# Altium project CurrentSens.PrjPCB
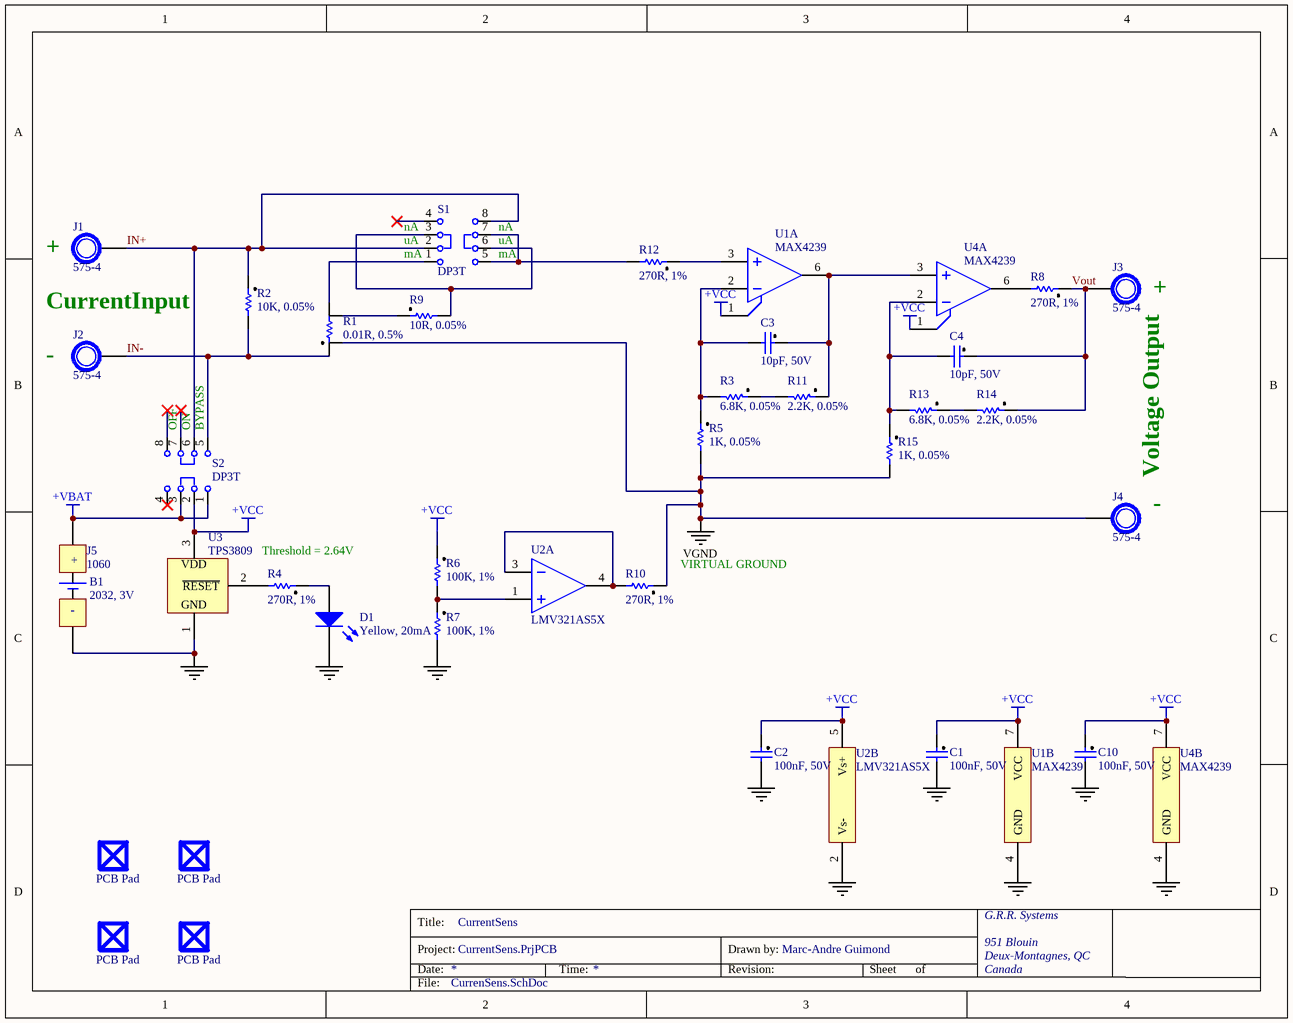
[diagram p0: CurrenSens.SchDoc]
1 sheet, 37 parts. Net scope: global (net labels, ports and power ports of the same name join across sheets).
Board files: CurrentSens.PcbDoc, TempSens_Panel.PcbDoc

## Sheet CurrenSens.SchDoc: CurrentSens
size A; DrawnBy: Marc-Andre Guimond; Organization: G.R.R. Systems; Address2: 951 Blouin; Address3: Deux-Montagnes, QC; Address4: Canada

### Parts
B1  2032, 3V  [NO_FOOT]
C1  100nF, 50V  [0603 (1608 Metric)]
C2  100nF, 50V  [0603 (1608 Metric)]
C3  10pF, 50V  [0603 (1608 Metric)]
C4  10pF, 50V  [0603 (1608 Metric)]
C10  100nF, 50V  [0603 (1608 Metric)]
D1  Yellow, 20mA  [1206 (3216 Metric)]
H1  PCB Pad  [SJ-5518]
H2  PCB Pad  [SJ-5518]
H3  PCB Pad  [SJ-5518]
H4  PCB Pad  [SJ-5518]
J1  575-4  [CON_BANANA_TH_NI]
J2  575-4  [CON_BANANA_TH_NI]
J3  575-4  [CON_BANANA_TH_NI]
J4  575-4  [CON_BANANA_TH_NI]
J5  1060  [1060]
R1  0.01R, 0.5%  [2512 (6432 Metric)]
R2  10K, 0.05%  [0603 (1608 Metric)]
R3  6.8K, 0.05%  [0603 (1608 Metric)]
R4  270R, 1%  [0603 (1608 Metric)]
R5  1K, 0.05%  [0603 (1608 Metric)]
R6  100K, 1%  [0603 (1608 Metric)]
R7  100K, 1%  [0603 (1608 Metric)]
R8  270R, 1%  [0603 (1608 Metric)]
R9  10R, 0.05%  [0805 (2012 Metric)]
R10  270R, 1%  [0603 (1608 Metric)]
R11  2.2K, 0.05%  [0603 (1608 Metric)]
R12  270R, 1%  [0603 (1608 Metric)]
R13  6.8K, 0.05%  [0603 (1608 Metric)]
R14  2.2K, 0.05%  [0603 (1608 Metric)]
R15  1K, 0.05%  [0603 (1608 Metric)]
S1  DP3T  [L203-MS]
S2  DP3T  [L203-MS]
U1  MAX4239  [SOIC8_154MIL]  (parts A,B of 2)
U2  LMV321AS5X  [SOT23-5]  (parts A,B of 2)
U3  TPS3809  [SOT23-3]
U4  MAX4239  [SOIC8_154MIL]  (parts A,B of 2)

### Nets
+VBAT: J5.1 S2.1 S2.3
+VCC: C1.1 C2.1 C10.1 R6.1 S2.2 U1.1(~{SHDN}) U1.7(VCC) U2.5(Vs+) U3.3(VDD) U4.1(~{SHDN}) U4.7(VCC)
GND: C1.2 C2.2 C10.2 D1.2(K) J5.2 R7.2 U1.4(GND) U2.2(Vs-) U3.1(GND) U4.4(GND)
VGND: J4.1 R1.3 R5.2 R10.1 R15.2
IN+: J1.1 R2.1 S1.2 S1.8 S2.6
IN-: J2.1 R1.1 R2.2 S2.5
Vout: C4.1 J3.1 R8.1 R14.1
NetC3_1: C3.1 R11.1 U1.6(OUT) U4.3(IN+)
NetC3_2: C3.2 R3.2 R5.1 U1.2(IN-)
NetC4_2: C4.2 R13.2 R15.1 U4.2(IN-)
NetD1_1: D1.1(A) R4.1
NetR1_2: R1.2 S1.1
NetR1_4: R1.4 R9.1
NetR3_1: R3.1 R11.2
NetR4_2: R4.2 U3.2(~{RESET})
NetR6_2: R6.2 R7.1 U2.1(IN+)
NetR8_2: R8.2 U4.6(OUT)
NetR9_2: R9.2 S1.3 S1.6
NetR10_2: R10.2 U2.3(IN-) U2.4(OUT)
NetR12_1: R12.1 U1.3(IN+)
NetR12_2: R12.2 S1.5 S1.7
NetR13_1: R13.1 R14.2

Not connected (* = marked no-connect by the designer): S1 4*; S2 4* 7* 8*; U1 5(NC) 8(NC); U4 5(NC) 8(NC)

### Notes on the sheet
- (near S1) nA
- (near J1) +
- (near S1) mA
- (near S1) uA
- (near J3) +
- (near J2) -
- CurrentInput
- (near S2) OFF
- (near S2) ON
- (near S2) BYPASS
- Voltage Output
- Threshold = 2.64V
- (near R10) VIRTUAL GROUND
- (near J4) -
- Title:
- Date:
- Project:
- Time:
- Revision:
- Drawn by:
- Sheet
- of
- File:
- (in symbol 1060) +; -

### Library data of the parts
B1 = CR2032: BATTERY LITHIUM COIN 3V 20MM; Manufacturer: Panasonic - BSG; Battery Cell Size: Coin, 20.0mm; Capacity: 225mAh; Discharge Rate: 200µA; Shipping Info: Due to possible restrictions, a change in ship method may be required.; Supplier 1: Digi-Key; Manufacturer Part Number: CR2032; RoHS: RoHS Compliant By Exemption; Category: Battery Products; Stock 1: 780134; Pricing 1: 1=0.34, 10=0.307, 50=0.2732, 200=0.2391, 400=0.21858, 600=0.20492, 1000=0.18785, 2600=0.17641 (CAD); Battery Chemistry: Lithium; Voltage - Rated: 3V; Size / Dimension: 0.79" Dia x 0.13" H (20.0mm x 3.2mm); Termination Style: Requires Holder; Weight: 0.1 oz (2.85g); ComponentLink1URL: http://na.industrial.panasonic.com/sites/default/pidsa/files/crseries_datasheets_merged.pdf; ComponentLink1Description: http://na.industrial.panasonic.com/sites/default/pidsa/files/crseries_datasheets_merged.pdf; GRRComment: 2032, 3V; Emplacement: *
C1 C2 C10 = CL10B104KB8SFNC: CAP CER 100NF 50V 10% X7R 0603; Manufacturer: Samsung Electro-Mechanics America, Inc; Supplier 1: Digi-Key; Manufacturer Part Number: CL10B104KB8SFNC; RoHS: RoHS Compliant; Category: Capacitors; Stock 1: 719425; Pricing 1: 1=0.12, 10=0.024, 25=0.0168, 50=0.013, 100=0.011, 250=0.00896, 500=0.00766, 1000=0.00597 (CAD); Packaging: Cut Tape (CT); Capacitance: 100nF; Tolerance: ±10%; Voltage - Rated: 50V; Temperature Coefficient: X7R; Mounting Type: Surface Mount, MLCC; Operating Temperature: -55°C ~ 125°C; Applications: Boardflex Sensitive; Ratings: -; Package / Case: 0603 (1608 Metric); Size / Dimension: 0.063" L x 0.031" W (1.60mm x 0.80mm); Height - Seated (Max): -; Thickness (Max): 0.035" (0.90mm); Lead Spacing: -; Features: Soft Termination; Lead Style: -; ComponentLink1URL: http://www.samsungsem.com/servlet/FileDownload?type=spec&file=CL10B104KB8SFNC.pdf; ComponentLink1Description: http://www.samsungsem.com/servlet/FileDownload?type=spec&file=CL10B104KB8SFNC.pdf; Supplier Part Number 1: 1276-1936-1-ND; Emplacement: *; GRRComment: 100nF, 50V
C3 C4 = CL10C100JB8NCNC: CAP CER 10PF 50V 5% NP0 0603; Manufacturer: Samsung Electro-Mechanics America, Inc; Temperature Coefficient: C0G, NP0; Emplacement: *; GRRComment: 10pF, 50V; Supplier 1: Digi-Key; Manufacturer Part Number: CL10C100JB8NCNC; RoHS: RoHS Compliant; Category: Capacitors; Stock 1: 90519; Pricing 1: 1=0.12, 25=0.008, 50=0.0066, 100=0.0054, 250=0.00444, 500=0.00382, 1000=0.00297 (CAD); Packaging: Cut Tape (CT); Capacitance: 10pF; Tolerance: ±5%; Voltage - Rated: 50V; Mounting Type: Surface Mount, MLCC; Operating Temperature: -55°C ~ 125°C; Applications: General Purpose; Ratings: -; Package / Case: 0603 (1608 Metric); Size / Dimension: 0.063" L x 0.031" W (1.60mm x 0.80mm); Height - Seated (Max): -; Thickness (Max): 0.035" (0.90mm); Lead Spacing: -; Features: -; Lead Style: -; ComponentLink1URL: http://www.samsungsem.com/servlet/FileDownload?type=spec&file=CL10C100JB8NCNC.pdf; ComponentLink1Description: http://www.samsungsem.com/servlet/FileDownload?type=spec&file=CL10C100JB8NCNC.pdf; Supplier Part Number 1: 1276-2154-1-ND
D1 = APTR3216SYCK: LED 3.2X1.6MM 590NM YLW CLR SMD; Manufacturer: Kingbright; Millicandela Rating: 150mcd; Voltage - Forward (Vf) (Typ): 2V; Viewing Angle: 120°; Lens Type: Clear; Lens Style/Size: Rectangle with Flat Top, 1.6mm x 1.4mm; Supplier 1: Digi-Key; Manufacturer Part Number: APTR3216SYCK; RoHS: RoHS Compliant; Category: Optoelectronics; Stock 1: 53956; Pricing 1: 1=0.25, 10=0.191, 25=0.152, 100=0.1372, 250=0.1266, 500=0.11394 (CAD); Packaging: Cut Tape (CT); Color: Yellow; Wavelength - Dominant: 590nm; Wavelength - Peak: 590nm; Current - Test: 20mA; Package / Case: 1206 (3216 Metric); Size / Dimension: 3.20mm L x 1.60mm W; Height: 1.05mm; Mounting Type: Surface Mount, Bottom Entry; Luminous Flux @ Current - Test: -; ComponentLink1URL: http://www.kingbrightusa.com/images/catalog/SPEC/APTR3216SYCK.pdf; ComponentLink1Description: http://www.kingbrightusa.com/images/catalog/SPEC/APTR3216SYCK.pdf; Supplier Part Number 1: 754-1174-1-ND; GRRComment: Yellow, 20mA; Emplacement: *
H1-H4 = SJ-5518 (BLACK): BUMPER SQUARE 0.5"L X 0.5"W BLK; Manufacturer: 3M; Shape: Square, Tapered; Hardness: 72 Shore M; Form: Sheet; GRRComment: PCB Pad; Emplacement: *; Supplier 1: Digi-Key; Manufacturer Part Number: SJ-5518 (BLACK); RoHS: RoHS Compliant; Category: Hardware, Fasteners, Accessories; Stock 1: 17272; Pricing 1: 64=0.13188 (CAD); Color: Black; Size / Dimension: 0.500" L x 0.500" W (12.70mm x 12.70mm); Thickness: 0.230" (5.84mm); Material: Polyurethane; Mounting Type: Adhesive, Rubber; ComponentLink1URL: http://multimedia.3m.com/mws/mediawebserver?6666660Zjcf6lVs6EVs666cIsCOrrrrQ-; ComponentLink1Description: http://multimedia.3m.com/mws/mediawebserver?6666660Zjcf6lVs6EVs666cIsCOrrrrQ-; Supplier Part Number 1: SJ5518-0-ND
J1-J4 = 575-4: JACK NON-INSULATED .218"; Manufacturer: Keystone Electronics; Gender: Female; Plug/Mating Plug Diameter: Standard; Supplier 1: Digi-Key; Manufacturer Part Number: 575-4; RoHS: RoHS Compliant; Category: Connectors, Interconnects; Stock 1: 33338; Pricing 1: 1=1.21, 10=0.938, 50=0.75, 100=0.7189, 250=0.65632, 500=0.62508, 1000=0.52488, 2500=0.46881, 5000=0.45318 (CAD); Packaging: Bulk; Type: Banana Jack; Mounting Type: Through Hole; Termination: Solder; Insulation: Non-Insulated; Features: -; Color: -; Contact Finish: Nickel; Contact Material: Brass; Body Material: -; Wire Gauge: -; Operating Temperature: -; ComponentLink1URL: http://www.keyelco.com/product-pdf.cfm?p=2379; ComponentLink1Description: http://www.keyelco.com/product-pdf.cfm?p=2379; Supplier Part Number 1: 575-4K-ND; Emplacement: *; GRRComment: 575-4
J5 = 1060: HOLDER BATT COIN 2032 20MM SMD; Manufacturer: Keystone Electronics; Battery Type, Function: Coin Cell, Holder; Style: Holder (Open); Battery Cell Size: Coin, 20.0mm; Number of Cells: 1; Battery Series: 2032; Supplier 1: Digi-Key; Manufacturer Part Number: 1060; RoHS: RoHS Compliant; Category: Battery Products; Stock 1: 7552; Pricing 1: 1=2.18, 10=1.8, 50=1.6158, 100=1.5424, 250=1.39548, 500=1.28532, 1000=1.23456, 2500=1.1017, 5000=0.97684 (CAD); Mounting Type: PCB, Surface Mount; Termination Style: SMD (SMT) Tab; Height Above Board: 0.217" (5.50mm); Operating Temperature: -50°C ~ 145°C; ComponentLink1URL: http://www.keyelco.com/product-pdf.cfm?p=726; ComponentLink1Description: http://www.keyelco.com/product-pdf.cfm?p=726; Supplier Part Number 1: 1060K-ND; Emplacement: *; GRRComment: 1060
R1 = LVK24R010DER: RES 0.01 OHM 1W 0.5% 2412; Manufacturer: Ohmite; Resistance (Ohms): 0.01; Temperature Coefficient: ±50ppm/°C; GRRComment: 0.01R, 0.5%; Emplacement: *; Supplier 1: Digi-Key; Manufacturer Part Number: LVK24R010DER; RoHS: RoHS Compliant; Category: Resistors; Stock 1: 1068; Pricing 1: 1=2.13, 10=1.887, 25=1.736, 50=1.5834, 100=1.3703, 250=1.15716, 500=0.97446 (CAD); Packaging: Cut Tape (CT); Tolerance: ±0.5%; Power (Watts): 1W; Composition: Thick Film; Features: Current Sense, Moisture Resistant; Package / Case: 2512 (6432 Metric); Supplier Device Package: 2412; Size / Dimension: 0.252" L x 0.126" W (6.40mm x 3.20mm); Height: 0.026" (0.65mm); Number of Terminations: 4; ComponentLink1URL: http://www.ohmite.com/cat/res_lvk.pdf; ComponentLink1Description: http://www.ohmite.com/cat/res_lvk.pdf; Supplier Part Number 1: LVK24R010DERCT-ND
R2 = RG1608N-103-W-T1: RES 10.0K OHM 1/10W .05% 0603SMD; Manufacturer: Susumu; Power (Watts): 0.1W, 1/10W; Temperature Coefficient: ±10ppm/°C; Supplier 1: Digi-Key; Manufacturer Part Number: RG1608N-103-W-T1; RoHS: RoHS Compliant; Category: Resistors; Stock 1: 91075; Pricing 1: 1=1.19, 10=1.041, 50=0.8358, 100=0.7253, 250=0.63096, 500=0.5231 (CAD); Packaging: Cut Tape (CT); Resistance (Ohms): 10k; Tolerance: ±0.05%; Composition: Thin Film; Features: -; Package / Case: 0603 (1608 Metric); Supplier Device Package: 0603; Size / Dimension: 0.063" L x 0.031" W (1.60mm x 0.80mm); Height: 0.020" (0.50mm); Number of Terminations: 2; ComponentLink1URL: http://www.susumu-usa.com/pdf/RG_RM_RGH_DATASHEET.pdf; ComponentLink1Description: http://www.susumu-usa.com/pdf/RG_RM_RGH_DATASHEET.pdf; Supplier Part Number 1: RG16N10.0KWCT-ND; Emplacement: *; GRRComment: 10K, 0.05%
R3 R13 = RG1608N-682-W-T1: RES 6.8K OHM 1/10W .05% 0603 SMD; Manufacturer: Susumu; Power (Watts): 0.1W, 1/10W; Temperature Coefficient: ±10ppm/°C; Supplier 1: Digi-Key; Manufacturer Part Number: RG1608N-682-W-T1; RoHS: RoHS Compliant; Category: Resistors; Stock 1: 4099; Pricing 1: 1=1.19, 10=1.041, 50=0.8358, 100=0.7253, 250=0.63096, 500=0.5231 (CAD); Packaging: Cut Tape (CT); Resistance (Ohms): 6.8k; Tolerance: ±0.05%; Composition: Thin Film; Features: -; Package / Case: 0603 (1608 Metric); Supplier Device Package: 0603; Size / Dimension: 0.063" L x 0.031" W (1.60mm x 0.80mm); Height: 0.020" (0.50mm); Number of Terminations: 2; ComponentLink1URL: http://www.susumu-usa.com/pdf/RG_RM_RGH_DATASHEET.pdf; ComponentLink1Description: http://www.susumu-usa.com/pdf/RG_RM_RGH_DATASHEET.pdf; Supplier Part Number 1: RG16N6.8KWCT-ND; GRRComment: 6.8K, 0.05%
R4 R8 R10 R12 = RMCF0805FT270R: RES 270 OHM 1/8W 1% 0805; Manufacturer: Stackpole Electronics Inc; Resistance (Ohms): 270; Power (Watts): 0.125W, 1/8W; Temperature Coefficient: ±100ppm/°C; Supplier 1: Digi-Key; Manufacturer Part Number: RMCF0805FT270R; RoHS: RoHS Compliant; Category: Resistors; Stock 1: 23909; Pricing 1: 1=0.13, 10=0.037, 50=0.0208, 100=0.0158, 250=0.01172, 500=0.00862, 1000=0.00575, 2500=0.00485 (CAD); Packaging: Cut Tape (CT); Tolerance: ±1%; Composition: Thick Film; Features: -; Package / Case: 0805 (2012 Metric); Supplier Device Package: 0805; Size / Dimension: 0.079" L x 0.049" W (2.00mm x 1.25mm); Height: 0.026" (0.65mm); Number of Terminations: 2; ComponentLink1URL: http://www.seielect.com/Catalog/SEI-RMCF_RMCP.pdf; ComponentLink1Description: http://www.seielect.com/Catalog/SEI-RMCF_RMCP.pdf; Supplier Part Number 1: RMCF0805FT270RCT-ND; Emplacement: *; GRRComment: 270R, 1%
R5 R15 = RG1608N-102-W-T1: RES 1K OHM 1/10W .05% 0603 SMD; Manufacturer: Susumu; Power (Watts): 0.1W, 1/10W; Temperature Coefficient: ±10ppm/°C; Supplier 1: Digi-Key; Manufacturer Part Number: RG1608N-102-W-T1; RoHS: RoHS Compliant; Category: Resistors; Stock 1: 34672; Pricing 1: 1=1.19, 10=1.041, 50=0.8358, 100=0.7253, 250=0.63096, 500=0.5231 (CAD); Packaging: Cut Tape (CT); Resistance (Ohms): 1k; Tolerance: ±0.05%; Composition: Thin Film; Features: -; Package / Case: 0603 (1608 Metric); Supplier Device Package: 0603; Size / Dimension: 0.063" L x 0.031" W (1.60mm x 0.80mm); Height: 0.020" (0.50mm); Number of Terminations: 2; ComponentLink1URL: http://www.susumu-usa.com/pdf/RG_RM_RGH_DATASHEET.pdf; ComponentLink1Description: http://www.susumu-usa.com/pdf/RG_RM_RGH_DATASHEET.pdf; Supplier Part Number 1: RG16N1.0KWCT-ND; GRRComment: 1K, 0.05%; Emplacement: *
R6 R7 = MCT06030C1003FP500: RES 100K OHM 1/8W 1% SMD 0603; Manufacturer: Vishay Beyschlag; Power (Watts): 0.125W, 1/8W; Temperature Coefficient: ±50ppm/°C; Supplier 1: Digi-Key; Supplier Part Number 1: MCT0603-100K-CFCT-ND; Manufacturer Part Number: MCT06030C1003FP500; RoHS: RoHS Compliant; Category: Resistors; Stock 1: 69094; Pricing 1: 1=0.1, 10=0.089, 50=0.0662, 100=0.0524, 500=0.04238, 1000=0.03082 (CAD); Packaging: Cut Tape (CT); Resistance (Ohms): 100k; Tolerance: ±1%; Composition: Thin Film; Features: -; Package / Case: 0603 (1608 Metric); Supplier Device Package: 0603; Size / Dimension: 0.061" L x 0.033" W (1.55mm x 0.85mm); Height: 0.022" (0.55mm); Number of Terminations: 2; ComponentLink1URL: http://www.vishay.com/docs/28705/mc_pro.pdf; ComponentLink1Description: http://www.vishay.com/docs/28705/mc_pro.pdf; GRRComment: 100K, 1%; Emplacement: *
R9 = RNCF0805AKT10R0: RES 10 OHM 1/10W 0.05% 0805; Manufacturer: Stackpole Electronics Inc; Resistance (Ohms): 10; Power (Watts): 0.1W, 1/10W; Temperature Coefficient: ±10ppm/°C; Supplier 1: Digi-Key; Manufacturer Part Number: RNCF0805AKT10R0; RoHS: RoHS Compliant; Category: Resistors; Stock 1: 3860; Pricing 1: 1=1.54, 10=1.387, 50=1.1402, 100=1.0478, 250=0.92448, 500=0.7704 (CAD); Packaging: Cut Tape (CT); Tolerance: ±0.05%; Composition: Thin Film; Features: -; Package / Case: 0805 (2012 Metric); Supplier Device Package: 0805; Size / Dimension: 0.079" L x 0.049" W (2.00mm x 1.25mm); Height: 0.026" (0.65mm); Number of Terminations: 2; ComponentLink1URL: http://www.seielect.com/Catalog/SEI-RNCF.pdf; ComponentLink1Description: http://www.seielect.com/Catalog/SEI-RNCF.pdf; Supplier Part Number 1: RNCF0805AKT10R0CT-ND; Emplacement: *; GRRComment: 10R, 0.05%
R11 R14 = RG1608N-222-W-T1: RES 2.2K OHM 1/10W .05% 0603 SMD; Manufacturer: Susumu; Power (Watts): 0.1W, 1/10W; Temperature Coefficient: ±10ppm/°C; Supplier 1: Digi-Key; Manufacturer Part Number: RG1608N-222-W-T1; RoHS: RoHS Compliant; Category: Resistors; Stock 1: 15040; Pricing 1: 1=1.19, 10=1.041, 50=0.8358, 100=0.7253, 250=0.63096, 500=0.5231 (CAD); Packaging: Cut Tape (CT); Resistance (Ohms): 2.2k; Tolerance: ±0.05%; Composition: Thin Film; Features: -; Package / Case: 0603 (1608 Metric); Supplier Device Package: 0603; Size / Dimension: 0.063" L x 0.031" W (1.60mm x 0.80mm); Height: 0.020" (0.50mm); Number of Terminations: 2; ComponentLink1URL: http://www.susumu-usa.com/pdf/RG_RM_RGH_DATASHEET.pdf; ComponentLink1Description: http://www.susumu-usa.com/pdf/RG_RM_RGH_DATASHEET.pdf; Supplier Part Number 1: RG16N2.2KWCT-ND; GRRComment: 2.2K, 0.05%; Emplacement: *
S1 S2 = L203011MS02Q: SWITCH SLIDE DP3T 4A PC 125V; Manufacturer: C&K Components; Contact Timing: Not Specified; Switch Function: On-On-On; Current Rating: 4A (AC/DC); Voltage Rating - DC: 28V; Actuator Type: Standard; Actuator Length: 5.08mm; Actuator Material: Polyamide (PA66), Nylon 6/6; Switch Travel: 4.06mm; Electrical Life: 10,000 Cycles; Supplier 1: Digi-Key; Manufacturer Part Number: L203011MS02Q; RoHS: RoHS Compliant; Category: Switches; Stock 1: 1512; Pricing 1: 1=3.88, 10=3.719, 50=3.1532, 100=3.0722, 250=3.03176, 500=2.5063, 1000=2.34458, 5000=2.18289 (CAD); Packaging: Bulk; Circuit: DP3T; Voltage Rating - AC: 125V; Contact Material: Copper; Contact Finish: Silver; Mounting Type: Through Hole; Termination Style: PC Pin; Features: -; Operating Temperature: -30°C ~ 65°C; Mechanical Life: -; Operating Force: -; ComponentLink1URL: http://www.ck-components.com/index.php?module=media&action=Display&cmpref=14386&lang=en&width=&height=&format=&alt=; ComponentLink1Description: http://www.ck-components.com/index.php?module=media&action=Display&cmpref=14386&lang=en&width=&height=&format=&alt=; Supplier Part Number 1: CKC5111-ND; Emplacement: *; GRRComment: DP3T
U1 U4 = MAX4239ASA+-ND: IC OPAMP GP 6.5MHZ RRO 8SOIC; Manufacturer: Maxim Integrated; Amplifier Type: General Purpose; Number of Circuits: 1; Output Type: Rail-to-Rail; Slew Rate: 1.6 V/µs; Current - Input Bias: 1pA; Voltage - Input Offset: 0.1µV; Current - Supply: 600µA; Current - Output / Channel: 40mA; Voltage - Supply, Single/Dual (±): 2.7 V ~ 5.5 V; Supplier 1: Digi-Key; Manufacturer Part Number: MAX4239ASA+; RoHS: RoHS Compliant; Category: Integrated Circuits (ICs); Stock 1: 175; Pricing 1: 1=2.35, 10=2.233, 50=2.2138 (CAD); Packaging: Tube; Gain Bandwidth Product: 6.5MHz; -3db Bandwidth: -; Operating Temperature: -40°C ~ 125°C; Mounting Type: Surface Mount; Package / Case: 8-SOIC (0.154", 3.90mm Width); Supplier Device Package: 8-SOIC N; ComponentLink1URL: http://datasheets.maximintegrated.com/en/ds/MAX4238-MAX4239.pdf; ComponentLink1Description: http://datasheets.maximintegrated.com/en/ds/MAX4238-MAX4239.pdf; Supplier Part Number 1: MAX4239ASA+-ND; GRRComment: MAX4239; Emplacement: *
U2 = LMV321AS5X: IC OPAMP VFB 1.4MHZ RRO SOT23-5; Manufacturer: Fairchild Semiconductor; Amplifier Type: Voltage Feedback; Number of Circuits: 1; Output Type: Rail-to-Rail; Slew Rate: 1.5 V/µs; Current - Input Bias: 1nA; Voltage - Input Offset: 1mV; Current - Supply: 100µA; Current - Output / Channel: 34mA; Voltage - Supply, Single/Dual (±): 2.7 V ~ 5.5 V, ±1.35 V ~ 2.75 V; GRRComment: LMV321; Supplier 1: Digi-Key; Manufacturer Part Number: LMV321AS5X; RoHS: RoHS Compliant; Category: Integrated Circuits (ICs); Stock 1: 16024; Pricing 1: 1=0.68, 10=0.531, 25=0.4476, 100=0.3647, 250=0.30212, 500=0.24958, 1000=0.18693 (CAD); Packaging: Cut Tape (CT); Gain Bandwidth Product: 1.4MHz; -3db Bandwidth: -; Operating Temperature: -40°C ~ 125°C; Mounting Type: Surface Mount; Package / Case: SC-74A, SOT-753; Supplier Device Package: SOT-23-5; ComponentLink1URL: http://www.fairchildsemi.com/datasheets/LM/LMV321.pdf; ComponentLink1Description: http://www.fairchildsemi.com/datasheets/LM/LMV321.pdf; Supplier Part Number 1: LMV321AS5XCT-ND; Emplacement: *
U3 = TPS3809L30DBVR: IC 2.64V SUPPLY MONITOR SOT-23-3; Manufacturer: Texas Instruments; Number of Voltages Monitored: 1; Output: Push-Pull, Totem Pole; Reset: Active Low; Reset Timeout: 120 ms Minimum; Supplier 1: Digi-Key; Manufacturer Part Number: TPS3809L30DBVR; RoHS: RoHS Compliant; Category: Integrated Circuits (ICs); Stock 1: 3510; Pricing 1: 1=0.98, 10=0.857, 25=0.7576, 100=0.6604, 250=0.57488, 500=0.48934, 750=0.42757, 1000=0.39194 (CAD); Packaging: Cut Tape (CT); Type: Simple Reset/Power-On Reset; Voltage - Threshold: 2.64V; Operating Temperature: -40°C ~ 85°C; Mounting Type: Surface Mount; Package / Case: TO-236-3, SC-59, SOT-23-3; Supplier Device Package: SOT-23-3; ComponentLink1URL: http://www.ti.com/lit/ds/symlink/tps3809i50.pdf; ComponentLink1Description: http://www.ti.com/lit/ds/symlink/tps3809i50.pdf; Supplier Part Number 1: 296-10917-1-ND; Emplacement: *; GRRComment: TPS3809